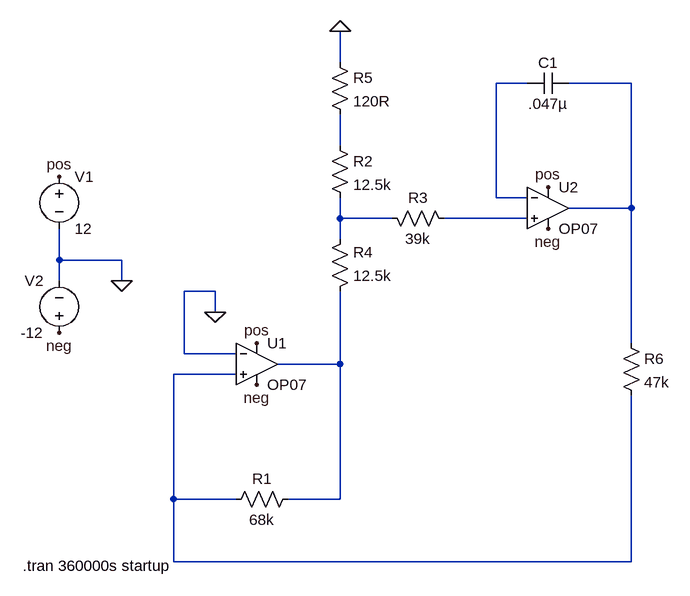
[diagram p0: schematic osc_test.asc]
osc_test.asc, the LTspice schematic file:
Version 4
SHEET 1 880 680
WIRE 320 -288 320 -336
WIRE 608 -256 560 -256
WIRE 768 -256 672 -256
WIRE 320 -160 320 -208
WIRE 560 -80 560 -256
WIRE 608 -80 560 -80
WIRE 768 -64 768 -256
WIRE 768 -64 672 -64
WIRE 320 -48 320 -80
WIRE 400 -48 320 -48
WIRE 608 -48 480 -48
WIRE 320 -16 320 -48
WIRE -112 16 -112 -32
WIRE -16 16 -112 16
WIRE -112 48 -112 16
WIRE -16 48 -16 16
WIRE 128 64 80 64
WIRE 128 96 128 64
WIRE 768 144 768 -64
WIRE 80 160 80 64
WIRE 160 160 80 160
WIRE 320 176 320 64
WIRE 320 176 224 176
WIRE 160 192 64 192
WIRE 64 384 64 192
WIRE 160 384 64 384
WIRE 320 384 320 176
WIRE 320 384 240 384
WIRE 64 480 64 384
WIRE 768 480 768 224
WIRE 768 480 64 480
FLAG -16 48 0
FLAG -112 -112 pos
FLAG -112 128 neg
FLAG 640 -32 neg
FLAG 192 208 neg
FLAG 640 -96 pos
FLAG 192 144 pos
FLAG 128 96 0
FLAG 320 -336 0
SYMBOL Opamps\\OP07 192 112 R0
SYMATTR InstName U1
SYMBOL Opamps\\OP07 640 -128 R0
SYMATTR InstName U2
SYMBOL res 256 368 R90
WINDOW 0 0 56 VBottom 2
WINDOW 3 32 56 VTop 2
SYMATTR InstName R1
SYMATTR Value 68k
SYMBOL res 304 -176 R0
SYMATTR InstName R2
SYMATTR Value 12.5k
SYMBOL res 384 -64 M90
WINDOW 0 0 56 VBottom 2
WINDOW 3 32 56 VTop 2
SYMATTR InstName R3
SYMATTR Value 39k
SYMBOL res 304 80 M180
WINDOW 0 36 76 Left 2
WINDOW 3 36 40 Left 2
SYMATTR InstName R4
SYMATTR Value 12.5k
SYMBOL res 304 -304 R0
SYMATTR InstName R5
SYMATTR Value 120R
SYMBOL cap 672 -272 R90
WINDOW 0 0 32 VBottom 2
WINDOW 3 32 32 VTop 2
SYMATTR InstName C1
SYMATTR Value .047µ
SYMBOL voltage -112 -128 R0
WINDOW 123 0 0 Left 0
WINDOW 39 0 0 Left 0
SYMATTR InstName V1
SYMATTR Value 12
SYMBOL voltage -112 144 R180
WINDOW 0 24 96 Left 2
WINDOW 3 24 16 Left 2
WINDOW 123 0 0 Left 0
WINDOW 39 0 0 Left 0
SYMATTR InstName V2
SYMATTR Value -12
SYMBOL res 752 128 R0
SYMATTR InstName R6
SYMATTR Value 47k
TEXT -168 486 Left 2 !.tran 360000s startup

The netlist it stands for:
* osc_test.asc
XU1 N007 0 pos neg N006 LT1001  ; OP07, pins In+ In- V+ V- OUT
XU2 N005 N001 pos neg N002 LT1001  ; OP07, pins In+ In- V+ V- OUT
R1 N006 N007 68k
R2 N003 N004 12.5k
R3 N004 N005 39k
R4 N006 N004 12.5k
R5 0 N003 120R
C1 N002 N001 .047µ
V1 pos 0 12
V2 neg 0 -12
R6 N002 N007 47k
.tran 360000s startup
.lib LTC.lib
.backanno
.end